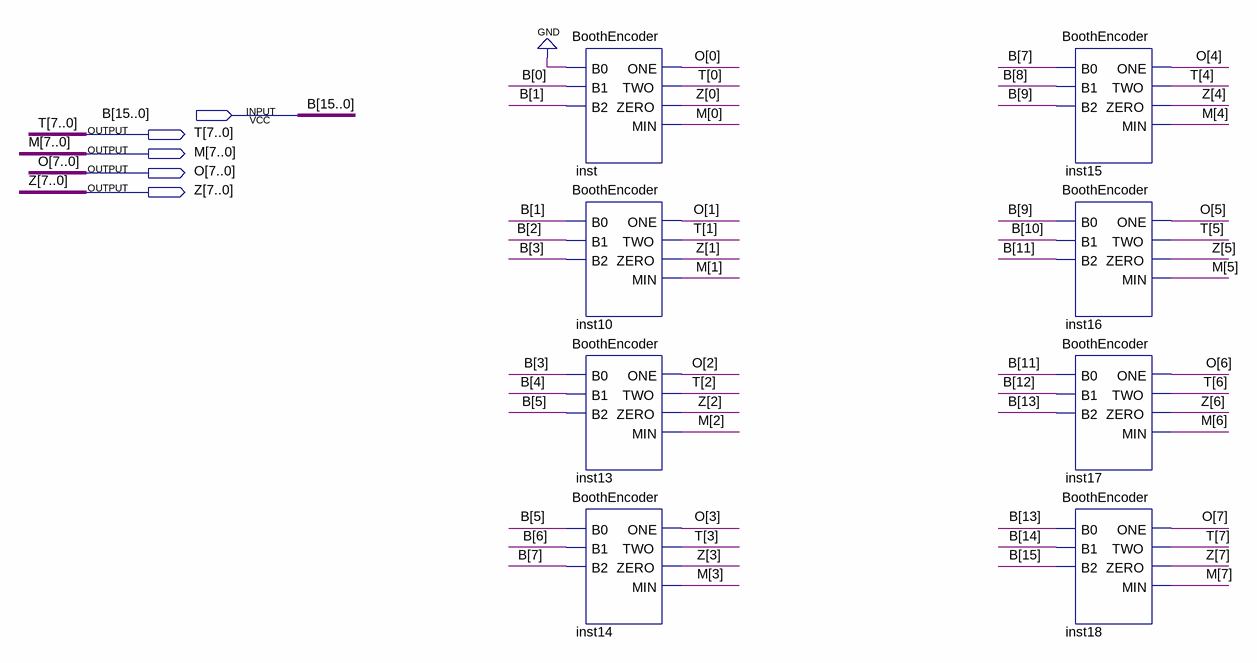
[diagram p0: schematic sheet]
// Quartus schematic BoothEncoder16b.bdf as structural Verilog: 8 symbols, 5 pins
module BoothEncoder16b (
  input  [15:0] B,
  output [7:0] T,
  output [7:0] M,
  output [7:0] O,
  output [7:0] Z
);

  BoothEncoder inst (.B0(1'b0), .B1(B[0]), .B2(B[1]), .ONE(O[0]), .TWO(T[0]), .ZERO(Z[0]), .MIN(M[0]));
  BoothEncoder inst10 (.B0(B[1]), .B1(B[2]), .B2(B[3]), .ONE(O[1]), .TWO(T[1]), .ZERO(Z[1]), .MIN(M[1]));
  BoothEncoder inst13 (.B0(B[3]), .B1(B[4]), .B2(B[5]), .ONE(O[2]), .TWO(T[2]), .ZERO(Z[2]), .MIN(M[2]));
  BoothEncoder inst14 (.B0(B[5]), .B1(B[6]), .B2(B[7]), .ONE(O[3]), .TWO(T[3]), .ZERO(Z[3]), .MIN(M[3]));
  BoothEncoder inst15 (.B0(B[7]), .B1(B[8]), .B2(B[9]), .ONE(O[4]), .TWO(T[4]), .ZERO(Z[4]), .MIN(M[4]));
  BoothEncoder inst16 (.B0(B[9]), .B1(B[10]), .B2(B[11]), .ONE(O[5]), .TWO(T[5]), .ZERO(Z[5]), .MIN(M[5]));
  BoothEncoder inst17 (.B0(B[11]), .B1(B[12]), .B2(B[13]), .ONE(O[6]), .TWO(T[6]), .ZERO(Z[6]), .MIN(M[6]));
  BoothEncoder inst18 (.B0(B[13]), .B1(B[14]), .B2(B[15]), .ONE(O[7]), .TWO(T[7]), .ZERO(Z[7]), .MIN(M[7]));
endmodule
